# Altium schematic sheet B2.0-主板-2.0-stm32c8t6最小系统板-24.10.17.SchDoc
size A4
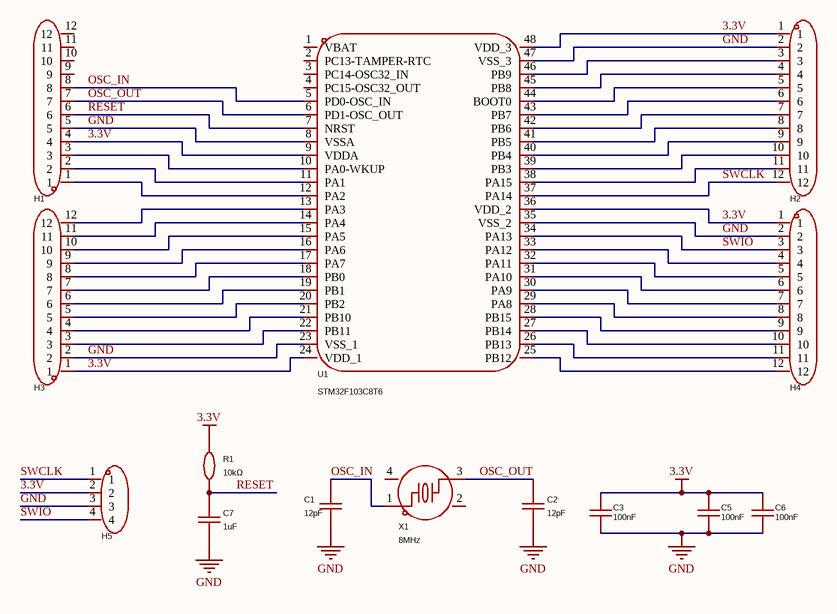
[diagram p0: B2.0-主板-2.0-stm32c8t6最小系统板-24.10.17.SchDoc]

## Parts
C1  12pF  [C0603]
C2  12pF  [C0603]
C3  100nF  [C0603]
C5  100nF  [C0603]
C6  100nF  [C0603]
C7  1uF  [C0603]
H1  PZ254V-11-12P  [HDR-TH_12P-P2.54-V-M]  (value not drawn)
H2  PZ254V-11-12P  [HDR-TH_12P-P2.54-V-M]  (value not drawn)
H3  PZ254V-11-12P  [HDR-TH_12P-P2.54-V-M]  (value not drawn)
H4  PZ254V-11-12P  [HDR-TH_12P-P2.54-V-M]  (value not drawn)
H5  PZ254V-11-04P  [HDR-TH_4P-P2.54-V-M]  (value not drawn)
R1  10kΩ  [R0805]
U1  STM32F103C8T6  [LQFP-48_L7.0-W7.0-P0.50-LS9.0-BL]
X1  8MHz  [OSC-SMD_4P-L3.2-W2.5-BL]

## Nets
3.3V: C3.2 C5.2 C6.2 H1.4 H2.1 H3.1 H4.1 H5.2 R1.2 U1.9(VDDA) U1.24(VDD_1) U1.36(VDD_2) U1.48(VDD_3)
GND: C1.1 C2.1 C3.1 C5.1 C6.1 C7.1 H1.5 H2.2 H3.2 H4.2 H5.3 U1.8(VSSA) U1.23(VSS_1) U1.35(VSS_2) U1.47(VSS_3)
OSC_IN: C1.2 H1.8 U1.5(PD0-OSC_IN) X1.1
OSC_OUT: C2.2 H1.7 U1.6(PD1-OSC_OUT) X1.3
RESET: C7.2 H1.6 R1.1 U1.7(NRST)
SWCLK: H2.12 H5.1 U1.37(PA14)
SWIO: H4.3 H5.4 U1.34(PA13)
NetH1_1: H1.1 U1.12(PA2)
NetH1_2: H1.2 U1.11(PA1)
NetH1_3: H1.3 U1.10(PA0-WKUP)
NetH2_3: H2.3 U1.46(PB9)
NetH2_4: H2.4 U1.45(PB8)
NetH2_5: H2.5 U1.44(BOOT0)
NetH2_6: H2.6 U1.43(PB7)
NetH2_7: H2.7 U1.42(PB6)
NetH2_8: H2.8 U1.41(PB5)
NetH2_9: H2.9 U1.40(PB4)
NetH2_10: H2.10 U1.39(PB3)
NetH2_11: H2.11 U1.38(PA15)
NetH3_3: H3.3 U1.22(PB11)
NetH3_4: H3.4 U1.21(PB10)
NetH3_5: H3.5 U1.20(PB2)
NetH3_6: H3.6 U1.19(PB1)
NetH3_7: H3.7 U1.18(PB0)
NetH3_8: H3.8 U1.17(PA7)
NetH3_9: H3.9 U1.16(PA6)
NetH3_10: H3.10 U1.15(PA5)
NetH3_11: H3.11 U1.14(PA4)
NetH3_12: H3.12 U1.13(PA3)
NetH4_4: H4.4 U1.33(PA12)
NetH4_5: H4.5 U1.32(PA11)
NetH4_6: H4.6 U1.31(PA10)
NetH4_7: H4.7 U1.30(PA9)
NetH4_8: H4.8 U1.29(PA8)
NetH4_9: H4.9 U1.28(PB15)
NetH4_10: H4.10 U1.27(PB14)
NetH4_11: H4.11 U1.26(PB13)
NetH4_12: H4.12 U1.25(PB12)

Not connected (* = marked no-connect by the designer): H1 9 10 11 12; U1 1(VBAT) 2(PC13-TAMPER-RTC) 3(PC14-OSC32_IN) 4(PC15-OSC32_OUT); X1 2(GND) 4(GND)

## Library data of the parts
C1 C2 = CC0603FRNPO9BN120: Manufacturer: YAGEO(国巨); Add into BOM: yes; Tolerance: ±1%; Voltage Rated: 50V; Temperature Coefficient: NP0; Symbol: CC0603FRNPO9BN120; Device: CC0603FRNPO9BN120; LCSC Part Name: 12pF ±1% 50V; Supplier Part: C519482; Manufacturer Part: CC0603FRNPO9BN120; Supplier Footprint: 0603; JLCPCB Part Class: Extended Part; Datasheet: https://atta.szlcsc.com/upload/public/pdf/source/20200423/C519482_89049CE53433C44DEC6365B4D6A7EBAA.pdf; Supplier: LCSC; Convert to PCB: yes; Value: 12pF; Comment_1: 12pF
C3 C5 C6 = 0603B104K500NT: Manufacturer: FH(风华); Add into BOM: yes; Tolerance: ±10%; Voltage Rated: 50V; Temperature Coefficient: X7R; Symbol: 0603B104K500NT; Device: 0603B104K500NT; LCSC Part Name: 100nF ±10% 50V; Supplier Part: C30926; Manufacturer Part: 0603B104K500NT; Supplier Footprint: 0603; JLCPCB Part Class: Extended Part; Datasheet: https://atta.szlcsc.com/upload/public/pdf/source/20200305/C486355_26A10D38EF8C2A5C37091D0039909270.pdf; Supplier: LCSC; Convert to PCB: yes; Value: 100nF; Comment_1: 100nF
C7 = CC0603KRX7R9BB105: Manufacturer: YAGEO(国巨); Add into BOM: yes; Tolerance: ±10%; Voltage Rated: 50V; Temperature Coefficient: X7R; Symbol: CC0603KRX7R9BB105; Device: CC0603KRX7R9BB105; LCSC Part Name: 1uF ±10% 50V; Supplier Part: C559769; Manufacturer Part: CC0603KRX7R9BB105; Supplier Footprint: 0603; JLCPCB Part Class: Extended Part; Datasheet: https://atta.szlcsc.com/upload/public/pdf/source/20181031/C325451_C7CF01155AE3010E0D610C52F5FE7D31.pdf; Supplier: LCSC; Convert to PCB: yes; Value: 1uF; Comment_1: 1uF
H1-H4 = PZ254V-11-12P: Manufacturer: XFCN(兴飞); Add into BOM: yes; Pin Structure: 1x12P; Pitch: 2.54mm; Circluar Pins/Square Pins: 方针; Current Rating (Max): 3A; Voltage Rating (Max): 250V; Symbol: PZ254V-11-12P; Device: PZ254V-11-12P; LCSC Part Name: 间距:2.54mm 1x12P 直插 方针; Supplier Part: C2840012; Manufacturer Part: PZ254V-11-12P; Supplier Footprint: 插件,P=2.54mm; JLCPCB Part Class: Extended Part; Datasheet: https://atta.szlcsc.com/upload/public/pdf/source/20200309/C492403_F9F19131791D08044AD4F84F8E751A34.pdf; Supplier: LCSC; Convert to PCB: yes; Row Spacing: -; Mounting Type: 直插; Number of Rows: 单排; Number of Pins: 12P; Length of Mating Pin: 6mm; Insulation Height: 2.5mm; Length of End Connection Pin: 3mm; Contact Material: -; Operating Temperature Range: -40℃~+105℃; Color: 黑色; Comment_1: PZ254V-11-12P
H5 = PZ254V-11-04P: Manufacturer: XFCN(兴飞); Symbol: PZ254V-11-04P_C2691448; Add into BOM: yes; Pin Structure: 1x4P; Pitch: 2.54mm; Circluar Pins/Square Pins: 方针; Current Rating (Max): 3A; Voltage Rating (Max): 250V; Device: PZ254V-11-04P; LCSC Part Name: 间距:2.54mm 1x4P 直插 方针; Supplier Part: C2691448; Manufacturer Part: PZ254V-11-04P; Supplier Footprint: 插件,P=2.54mm; JLCPCB Part Class: Extended Part; Datasheet: https://atta.szlcsc.com/upload/public/pdf/source/20200309/C492403_F9F19131791D08044AD4F84F8E751A34.pdf; Supplier: LCSC; Convert to PCB: yes; Row Spacing: -; Mounting Type: 直插; Number of Rows: 单排; Number of Pins: 4P; Length of Mating Pin: 6mm; Insulation Height: 2.5mm; Length of End Connection Pin: 3mm; Contact Material: -; Operating Temperature Range: -40℃~+105℃; Color: 黑色; Comment_1: PZ254V-11-04P
R1 = 0805W8J0103T5E: Manufacturer: UNI-ROYAL(厚声); Add into BOM: yes; Tolerance: ±5%; Power(Watts): 125mW; Overload Voltage (Max): 150V; Temperature Coefficient: ±100ppm/℃; Symbol: 0805W8J0103T5E; Device: 0805W8J0103T5E; LCSC Part Name: 10kΩ ±5% 125mW 厚膜电阻; Supplier Part: C25612; Manufacturer Part: 0805W8J0103T5E; Supplier Footprint: 0805; JLCPCB Part Class: Extended Part; Datasheet: https://atta.szlcsc.com/upload/public/pdf/source/20200306/C422600_1E6D84923E4A46A82E41ADD87F860B5C.pdf; Supplier: LCSC; Convert to PCB: yes; Type: 厚膜电阻; Value: 10kΩ; Operating Temperature Range: -55℃~+155℃; Comment_1: 10kΩ
U1 = STM32F103C8T6: Manufacturer: ST(意法半导体); Add into BOM: yes; CPU Core: ARM-M3; Program Storage Size: 64KB; RAM Size: 20KB; GPIO Ports Number: 37; Operating Voltage Range: 2V~3.6V; CPU Maximum Speed: 72MHz; Program Memory Type: FLASH; ADC (Bit): 12bit; Universal Serial Bus: 有; Peripheral/Function: 看门狗；DMA；看门狗；温度传感器; Symbol: stm32f103c8t6; Device: STM32F103C8T6; LCSC Part Name: 主流增强型ARM Cortex-M3 MCU，具有64 KB Flash、72 MHz CPU、电机控制、USB和CAN; Supplier Part: C8734; Manufacturer Part: STM32F103C8T6; Supplier Footprint: LQFP-48(7x7); JLCPCB Part Class: Extended Part; Datasheet: https://atta.szlcsc.com/upload/public/pdf/source/20220812/8363ACEC51AD55ECEB84799464F7CB85.pdf; Supplier: LCSC; Convert to PCB: yes; Operating Temperature Range: -40℃~+85℃; DAC (Bit): -; PWM (Bit): -; Internal Comparator: -; communication protocol: -; Watchdog: 有; Real-Time Clock: -; Infrared Data Association: 有; Low-Voltage Detect: 有; CCP Capture/Compare: -; Secure Digital Input and Output: -; Direct Memory Access: 有; Internal Oscillator: 有; Comment_1: STM32F103C8T6
X1 = X32258MOB4SI: Manufacturer: YXC(扬兴晶振); Add into BOM: yes; Crystal Type: 贴片晶振; Normal temperature Frequency Tolerance: ±10ppm; External load capacitor: 12pF; Frequency Stability(Full temperature range): ±20ppm; Equivalent Series Resistance (ESR): 150Ω; Symbol: x32258mob4si; Device: X32258MOB4SI; LCSC Part Name: 8MHz ±10ppm 12pF; Supplier Part: C2682775; Manufacturer Part: X32258MOB4SI; Supplier Footprint: SMD3225-4P; JLCPCB Part Class: Extended Part; Datasheet: https://atta.szlcsc.com/upload/public/pdf/source/20240329/19D5F850207469550BEB00D7DFEDBC7A.pdf; Supplier: LCSC; Convert to PCB: yes; Value: 8MHz; Operating Temperature: -40℃~+85℃; Comment_1: 8MHz